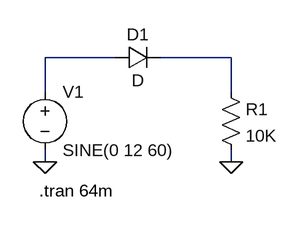
[diagram p0: schematic half_wave.asc]
half_wave.asc, the LTspice schematic file:
Version 4.1
SHEET 1 880 680
WIRE 192 96 96 96
WIRE 352 96 256 96
WIRE 96 144 96 96
WIRE 352 144 352 96
WIRE 96 240 96 224
WIRE 352 240 352 224
FLAG 96 240 0
FLAG 352 240 0
SYMBOL voltage 96 128 R0
WINDOW 123 0 0 Left 0
WINDOW 39 0 0 Left 0
SYMATTR InstName V1
SYMATTR Value SINE(0 12 60)
SYMBOL diode 192 112 R270
WINDOW 0 32 32 VTop 2
WINDOW 3 0 32 VBottom 2
SYMATTR InstName D1
SYMBOL res 336 128 R0
SYMATTR InstName R1
SYMATTR Value 10K
TEXT 88 280 Left 2 !.tran 64m

The netlist it stands for:
* half_wave.asc
V1 N001 0 SINE(0 12 60)
D1 N001 N002 D
R1 N002 0 10K
.model D D
.lib standard.dio
.tran 64m
.backanno
.end